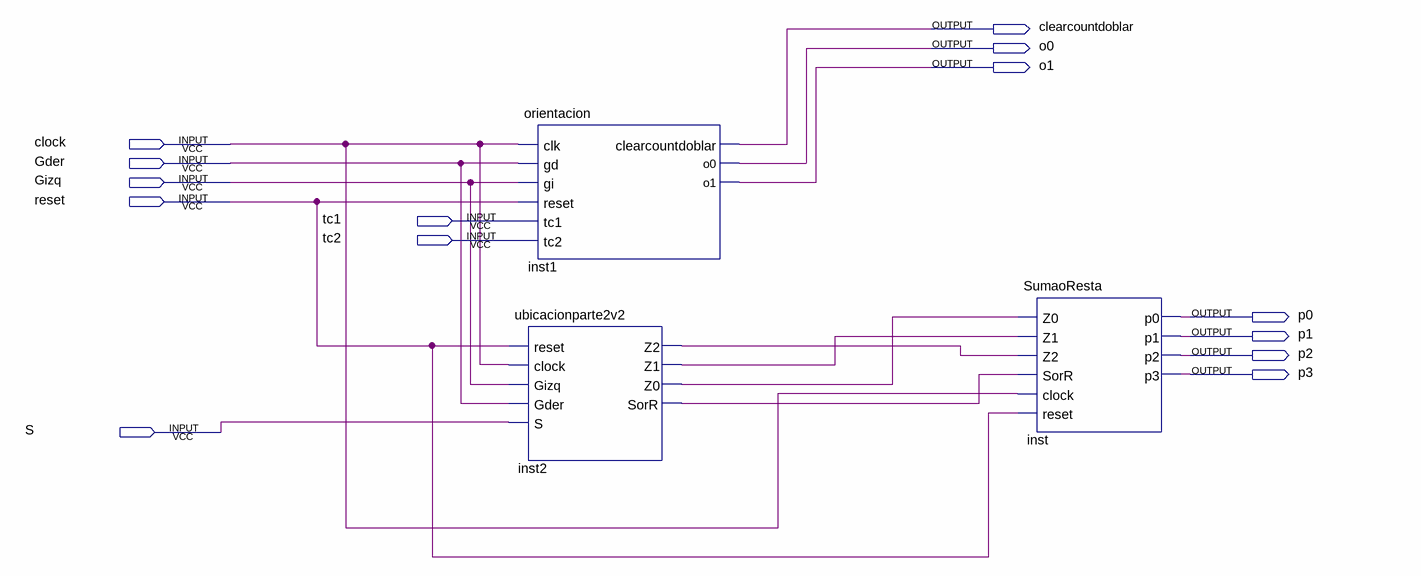
[diagram p0: schematic sheet]
// Quartus schematic ubicacion.bdf as structural Verilog: 3 symbols, 14 pins
module ubicacion (
  input  clock,
  input  Gder,
  input  Gizq,
  input  reset,
  input  tc1,
  input  tc2,
  input  S,
  output clearcountdoblar,
  output o0,
  output o1,
  output p0,
  output p1,
  output p2,
  output p3
);

  wire inst2_sorr, inst2_z0, inst2_z1, inst2_z2;

  orientacion inst1 (
    .clk(clock), .gd(Gder), .gi(Gizq), .reset(reset), .tc1(tc1), .tc2(tc2),
    .clearcountdoblar(clearcountdoblar), .o0(o0), .o1(o1));
  ubicacionparte2v2 inst2 (
    .reset(reset), .clock(clock), .Gizq(Gizq), .Gder(Gder), .S(S), .Z2(inst2_z2), .Z1(inst2_z1),
    .Z0(inst2_z0), .SorR(inst2_sorr));
  SumaoResta inst (
    .Z0(inst2_z0), .Z1(inst2_z1), .Z2(inst2_z2), .SorR(inst2_sorr), .clock(clock), .reset(reset), .p0(p0),
    .p1(p1), .p2(p2), .p3(p3));
endmodule
